# EAGLE design PCB-SSB-2x2 (EAGLE 6.4)
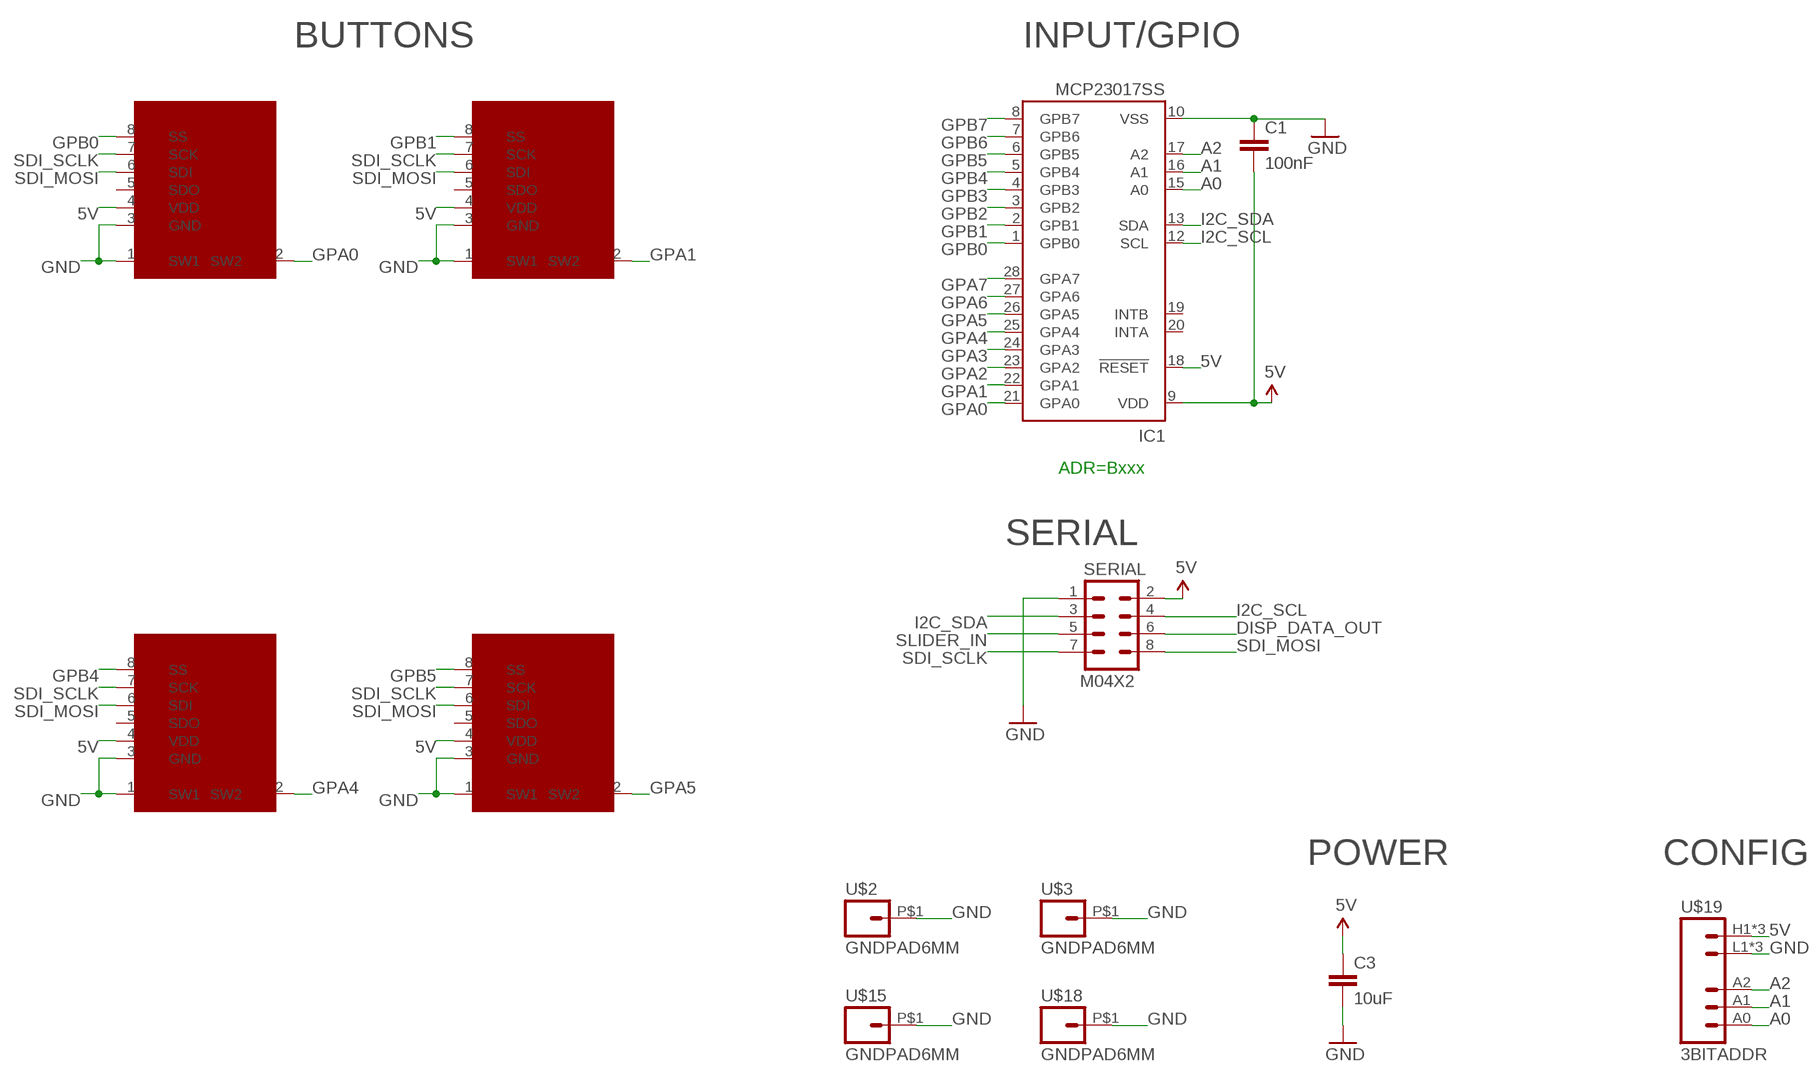
[diagram p0: schematic, sheet 1]

## Parts
C1  100nF  CAP0603-CAP  [0603-CAP]
C3  10uF  CAP0805  [0805]
IC1  MCP23017SS  [SSOP28]
SERIAL  M04X2  [2X4]
SSW1  SMART_SWITCHSMART_SWITCH_8PIN  [SMART_SWITCH]
SSW2  SMART_SWITCHSMART_SWITCH_8PIN  [SMART_SWITCH]
SSW5  SMART_SWITCHSMART_SWITCH_8PIN  [SMART_SWITCH]
SSW6  SMART_SWITCHSMART_SWITCH_8PIN  [SMART_SWITCH]
U$2  GNDPAD6MM  [3.2MMPAD6MM]
U$3  GNDPAD6MM  [3.2MMPAD6MM]
U$15  GNDPAD6MM  [3.2MMPAD6MM]
U$18  GNDPAD6MM  [3.2MMPAD6MM]
U$19  3BITADDR  [3BITADDR]

## Nets
5V [Power]: C1.2 C3.1 IC1.9(VDD) IC1.18(!RESET) SERIAL.2 SSW1.4(VDD) SSW2.4(VDD) SSW5.4(VDD) SSW6.4(VDD) U$19.H1(VCC) U$19.H2(VCC) U$19.H3(VCC)
A0: IC1.15(A0) U$19.A0
A1: IC1.16(A1) U$19.A1
A2: IC1.17(A2) U$19.A2
DISP_DATA_OUT: SERIAL.6
GND [Power]: C1.1 C3.2 IC1.10(VSS) SERIAL.1 SSW1.1(SW1) SSW1.3(GND) SSW2.1(SW1) SSW2.3(GND) SSW5.1(SW1) SSW5.3(GND) SSW6.1(SW1) SSW6.3(GND) U$2.P$1 U$3.P$1 U$15.P$1 U$18.P$1 U$19.L1(GND) U$19.L2(GND) U$19.L3(GND)
GPA0: IC1.21(GPA0) SSW1.2(SW2)
GPA1: IC1.22(GPA1) SSW2.2(SW2)
GPA2: IC1.23(GPA2)
GPA3: IC1.24(GPA3)
GPA4: IC1.25(GPA4) SSW5.2(SW2)
GPA5: IC1.26(GPA5) SSW6.2(SW2)
GPA6: IC1.27(GPA6)
GPA7: IC1.28(GPA7)
GPB0: IC1.1(GPB0) SSW1.8(SS)
GPB1: IC1.2(GPB1) SSW2.8(SS)
GPB2: IC1.3(GPB2)
GPB3: IC1.4(GPB3)
GPB4: IC1.5(GPB4) SSW5.8(SS)
GPB5: IC1.6(GPB5) SSW6.8(SS)
GPB6: IC1.7(GPB6)
GPB7: IC1.8(GPB7)
I2C_SCL: IC1.12(SCL) SERIAL.4
I2C_SDA: IC1.13(SDA) SERIAL.3
SDI_MOSI: SERIAL.8 SSW1.6(SDI) SSW2.6(SDI) SSW5.6(SDI) SSW6.6(SDI)
SDI_SCLK: SERIAL.7 SSW1.7(SCK) SSW2.7(SCK) SSW5.7(SCK) SSW6.7(SCK)
SLIDER_IN: SERIAL.5
Unconnected: IC1.19(INTB) IC1.20(INTA) SSW1.5(SDO) SSW2.5(SDO) SSW5.5(SDO) SSW6.5(SDO)

## Notes on the sheet
- BUTTONS | INPUT/GPIO
- ADR=Bxxx
- SERIAL
- POWER | CONFIG

## Library data of the parts
C1 C3 = SparkFun:CAP: Capacitor Standard 0603 ceramic capacitor, and 0.1" leaded capacitor.
IC1 = microchip:MCP23017: http://ww1.microchip.com/downloads/en/DeviceDoc/21952a.pdf Source: http://ww1.microchip.com/downloads/en/DeviceDoc/21952a.pdf; MF: MICROCHIP; MPN: MCP23017-E/SS; OC_FARNELL: 1467674; OC_NEWARK: 31K2960
SERIAL = SparkFun:M04X2
SSW1 SSW2 SSW5 SSW6 = SKAARHOJ:SMART_SWITCH: SMARTSWITCH IS15DSBFP4RGB www.nkksmartswitch.com
U$2 U$3 U$15 U$18 = SKAARHOJ:GNDPAD
U$19 = SKAARHOJ:3BITADDR

## Net classes
0 default: width 0.203 mm, drill 0.406 mm, clearance 0.203 mm
1 Power: width 0.406 mm, drill 0.61 mm, clearance 0.203 mm

## Board
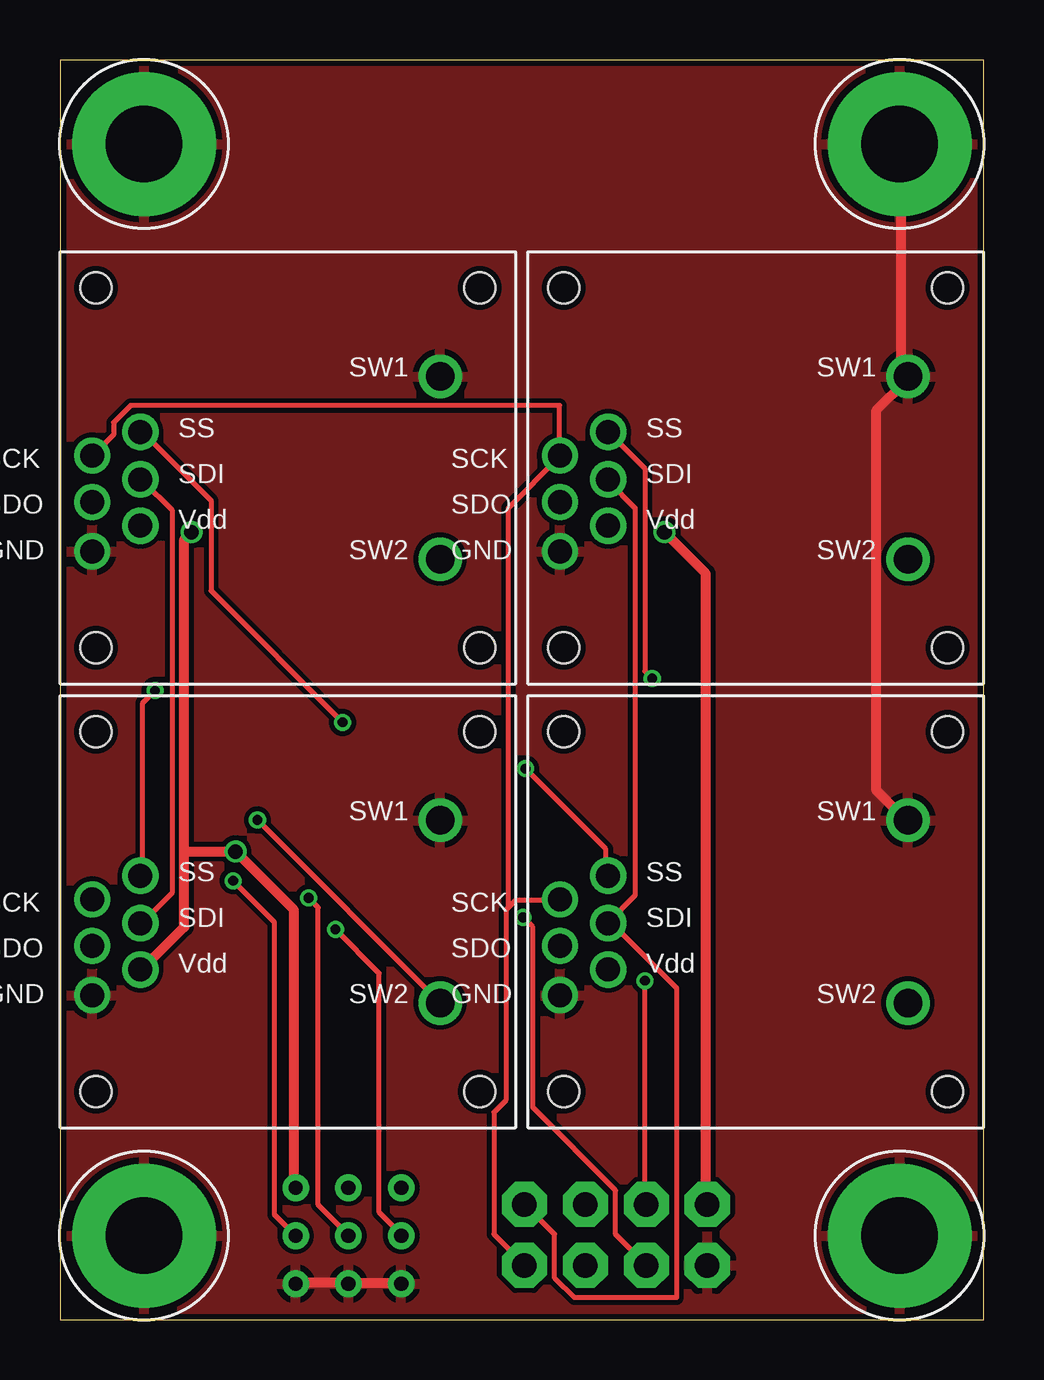
[diagram p1: board, top side]
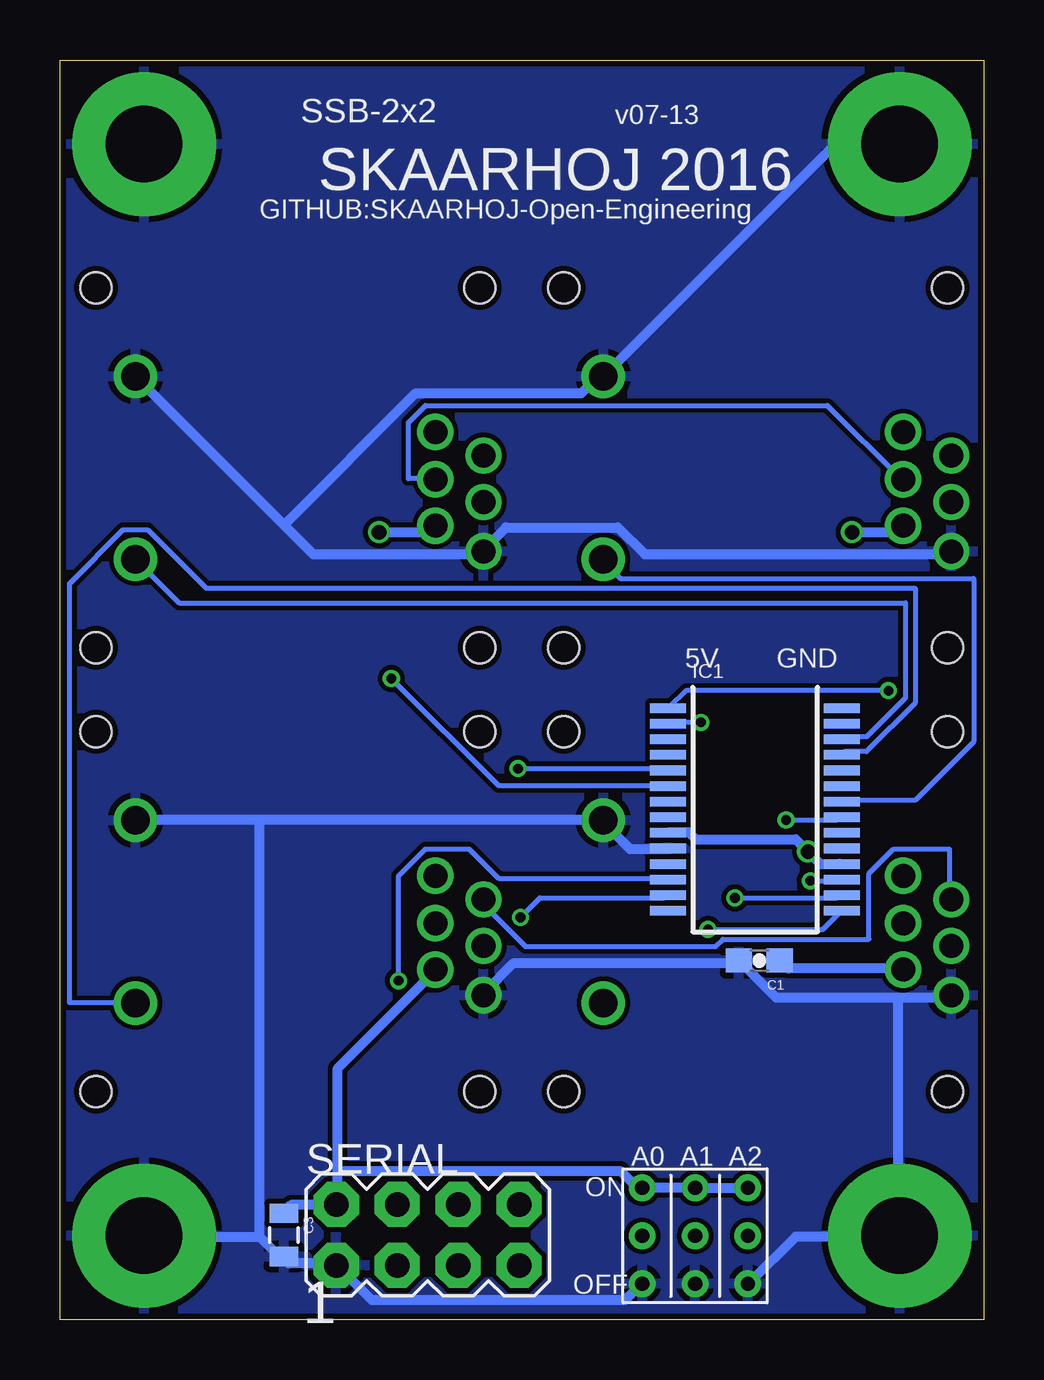
[diagram p2: board, bottom side, seen from below]

Size 38.5 x 52.5 mm. Coordinates in mm from the lower left corner, seen from the top.
Outline: 0,0 38.5,0 38.5,52.5 0,52.5 0,0
Copper layers (1*16): Top 0.035mm / dielectric 1.5mm / Bottom 0.035mm
Design rules "default": minimum track width 6mil, minimum drill 12mil, track to track 6mil, track to pad 6mil, pad to pad 6mil, via to via 6mil, smd to smd 0mil, copper to edge 10mil, drill to drill 10mil, minimum pad ring 10mil, minimum via ring 6mil, stop-mask expansion 2mil, vias tented up to drill 100mil, thermal gap 10mil

### Footprints (pad centres in the part's own frame; a part is rotated, then mirrored left to right if it is on the bottom)
0603-CAP = smd 1.1 x 1: 1 -0.85,0; 2 0.85,0
0805 = smd 0.8 x 1.2: 1 -0.9,0; 2 0.9,0
SSOP28 = smd 0.4 x 1.5: 1 -4.225,-3.625; 2 -3.575,-3.625; 3 -2.925,-3.625; 4 -2.275,-3.625; 5 -1.625,-3.625; 6 -0.975,-3.625; 7 -0.325,-3.625; 8 0.325,-3.625; 9 0.975,-3.625; 10 1.625,-3.625; 11 2.275,-3.625; 12 2.925,-3.625; 13 3.575,-3.625; 14 4.225,-3.625; 15 4.225,3.625; 16 3.575,3.625; 17 2.925,3.625; 18 2.275,3.625; 19 1.625,3.625; 20 0.975,3.625; 21 0.325,3.625; 22 -0.325,3.625; 23 -0.975,3.625; 24 -1.625,3.625; 25 -2.275,3.625; 26 -2.925,3.625; 27 -3.575,3.625; 28 -4.225,3.625
2X4 = drill 1.016 pad 1.88 octagon: 1 -3.81,-1.27; 2 -3.81,1.27; 3 -1.27,-1.27; 4 -1.27,1.27; 5 1.27,-1.27; 6 1.27,1.27; 7 3.81,-1.27; 8 3.81,1.27
SMART_SWITCH = drill 1.2: 1 6.35,3.81; 2 6.35,-3.81 | drill 1: 3 -8.153,-3.48; 4 -6.147,-2.413; 5 -8.153,-1.422; 6 -6.147,-0.483; 7 -8.153,0.508; 8 -6.147,1.499 | hole 1.3: -8.001,7.506; 8.001,7.506; 8.001,-7.506; -8.001,-7.506
3.2MMPAD6MM = drill 3.2 pad 6: P$1 0,0
3BITADDR = drill 0.6: A0 -2.2,0; A1 0,0; A2 2.2,0; H1 -2.2,2; H2 0,2; H3 2.2,2; L1 -2.2,-2; L2 0,-2; L3 2.2,-2

### Placement (x,y rotation side)
C1  9.35,14.96 0 bottom
C3  29.16,3.52 270 bottom
IC1  9.53,21.26 270 bottom
SERIAL  23.17,3.52 0 bottom
SSW1  9.5,17 0 top
SSW2  9.5,35.5 0 top
SSW5  29,17 0 top
SSW6  29,35.5 0 top
U$2  3.5,3.5 0 top
U$3  3.5,49 0 top
U$15  35,3.5 0 top
U$18  35,49 0 top
U$19  12.03,3.49 0 bottom

### Tracks (layer width: path | path; a pad name or v marks a point on that pad's centre or on a via)
5V  (via drill 0.61)
  Top 0.406: v5.49,32.82 5.18,32.51 5.18,19.51 | 5.18,19.51 5.18,16.36 3.45,14.63 SSW1.4 | 5.18,19.51 v7.32,19.51 9.75,17.07 9.75,5.59 U$19.H3 | v25.2,32.82 26.92,31.09 26.92,4.88 SERIAL.2
  Bottom 0.406: IC1.18 5.99,19 6.81,19 v7.32,19.51 7.82,20.02 11.99,20.02 12.29,20.32 13.11,20.32 IC1.9 | C1.2 8.43,14.94 8.13,14.63 3.45,14.63 SSW1.4 | v5.49,32.82 3.66,32.82 3.45,33.02 SSW2.4 | U$19.H3 9.86,5.49 11.99,5.49 U$19.H2 12.19,5.49 U$19.H1 14.43,5.49 15.14,6.2 26.92,6.2 | C3.1 29.16,4.47 28.85,4.78 27.03,4.78 SERIAL.2 26.92,4.98 26.92,6.2 | 26.92,6.2 26.92,10.46 22.86,14.53 SSW5.4 | v25.2,32.82 23.06,32.82 22.86,33.02 SSW6.4
A0  (via drill 0.41)
  Top 0.203: v11.48,16.26 13.31,14.43 13.31,4.47 14.22,3.56 U$19.A0
  Bottom 0.203: v11.48,16.26 6.71,16.26 5.99,16.97 IC1.15
A1  (via drill 0.41)
  Top 0.203: v10.36,17.58 10.77,17.17 10.77,4.78 11.99,3.56 U$19.A1
  Bottom 0.203: v10.36,17.58 6.1,17.58 5.99,17.68 IC1.16
A2  (via drill 0.41)
  Top 0.203: v7.21,18.29 8.94,16.56 8.94,4.37 9.75,3.56 U$19.A2
  Bottom 0.203: v7.21,18.29 5.99,18.29 IC1.17
GND
  Top 0.406: U$18.P$1 35.05,48.97 35.05,39.52 35.26,39.32 SSW6.1 35.26,39.12 34.04,37.9 34.04,22.05 35.26,20.83 SSW5.1 | U$19.L3 9.86,1.52 11.99,1.52 U$19.L2 12.19,1.52 14.22,1.52 U$19.L1
  Bottom 0.406: U$3.P$1 3.56,48.97 6.2,48.97 SSW2.1 16.05,39.32 16.76,38.61 23.67,38.61 29.16,33.12 | SSW2.3 1.42,32 1.52,31.9 14.12,31.9 15.24,33.02 19.91,33.02 20.83,32.11 SSW6.3 21.03,32 21.13,31.9 27.94,31.9 29.16,33.12 | 29.16,33.12 35.26,39.22 SSW6.1 | 3.56,13.41 1.52,13.41 1.42,13.51 SSW1.3 | 3.56,13.41 8.64,13.41 10.16,14.94 C1.1 10.36,14.83 19.61,14.83 20.83,13.61 SSW5.3 | U$19.L3 9.75,1.52 7.82,3.45 3.56,3.45 U$2.P$1 3.56,3.66 3.56,13.41 | IC1.10 13.21,19.61 14.73,19.61 15.85,20.73 SSW1.1 16.05,20.83 30.18,20.83 | 30.18,20.83 35.26,20.83 SSW5.1 | 30.18,3.45 29.36,2.64 C3.2 29.16,2.54 28.96,2.34 27.03,2.34 SERIAL.1 26.82,2.13 25.5,0.81 14.94,0.81 14.33,1.42 U$19.L1 | 30.18,3.45 34.95,3.45 U$15.P$1 | 30.18,3.45 30.18,20.83
  pour Top: 0,0 38.5,0 38.5,52.5 0,52.5
  pour Bottom: 0,0 38.5,0 38.5,52.5 0,52.5 0,0.5
GPA0  (via drill 0.41)
  Top 0.203: v8.23,20.83 15.85,13.21 SSW1.2
  Bottom 0.203: v8.23,20.83 6.1,20.83 5.99,20.93 IC1.21
GPA1
  Bottom 0.203: IC1.22 5.89,21.64 2.85,21.64 0.41,24.08 0.41,30.89 15.14,30.89 15.85,31.6 SSW2.2
GPA4
  Bottom 0.203: IC1.25 5.89,23.57 5.79,23.67 4.88,23.67 2.85,25.7 2.85,30.48 32.41,30.48 34.85,32.92 35.87,32.92 38.1,30.68 38.1,13.21 35.36,13.21 SSW5.2
GPA5
  Bottom 0.203: IC1.26 5.89,24.28 4.88,24.28 3.25,25.91 3.25,29.87 33.53,29.87 35.26,31.6 SSW6.2
GPB0  (via drill 0.41)
  Top 0.203: v3.96,26.21 3.45,25.7 3.45,18.59 SSW1.8
  Bottom 0.203: v3.96,26.21 12.39,26.21 13.11,25.5 IC1.1
GPB1  (via drill 0.41)
  Top 0.203: v11.79,24.89 6.3,30.38 6.3,34.14 3.45,36.98 SSW2.8
  Bottom 0.203: v11.79,24.89 13.11,24.89 IC1.2
GPB4  (via drill 0.41)
  Top 0.203: v19.41,22.96 22.76,19.61 22.76,18.59 SSW5.8
  Bottom 0.203: v19.41,22.96 13.21,22.96 IC1.5
GPB5  (via drill 0.41)
  Top 0.203: v24.69,26.72 24.38,27.03 24.38,35.46 22.86,36.98 SSW6.8
  Bottom 0.203: v24.69,26.72 20.22,22.25 13.21,22.25 IC1.6
I2C_SCL  (via drill 0.41)
  Top 0.203: v24.38,14.12 24.38,4.88 SERIAL.4
  Bottom 0.203: v24.38,14.12 24.38,18.49 23.27,19.61 21.44,19.61 20.22,18.39 13.21,18.39 IC1.12
I2C_SDA  (via drill 0.41)
  Top 0.203: v19.3,16.76 19.71,16.36 19.71,8.84 23.16,5.38 23.16,3.56 24.38,2.34 SERIAL.3
  Bottom 0.203: v19.3,16.76 18.49,17.58 13.31,17.58 13.21,17.68 IC1.13
SDI_MOSI
  Top 0.203: SSW1.6 3.45,16.56 4.67,17.78 4.67,33.73 3.45,34.95 SSW2.6 | SSW6.6 22.86,34.95 23.98,33.83 23.98,17.68 22.86,16.56 SSW5.6 22.96,16.56 25.7,13.82 25.7,0.91 21.44,0.91 20.62,1.73 20.62,3.56 19.41,4.78 SERIAL.8
  Bottom 0.203: SSW2.6 3.45,35.05 6.5,38.1 23.27,38.1 23.98,37.39 23.98,35.05 22.86,35.05 SSW6.6
SDI_SCLK
  Top 0.203: SSW2.7 1.42,36.07 2.23,36.88 2.23,37.39 2.95,38.1 20.83,38.1 20.83,36.07 SSW6.7 20.83,35.97 18.69,33.83 18.69,17.27 18.75,17.22 | 18.75,17.22 19,17.48 20.83,17.48 SSW5.7 | 18.75,17.22 18.59,17.07 18.59,9.14 18.09,8.64 18.09,3.56 19.3,2.34 SERIAL.7
  Bottom 0.203: SSW1.7 1.42,17.58 1.42,19.61 3.76,19.61 4.78,18.59 4.78,15.85 10.87,15.85 11.18,15.54 19.1,15.54 20.83,17.27 20.83,17.48 SSW5.7

### Text on the board
_bsilk: v07-13 | SSB-2x2 | SKAARHOJ 2016 | GITHUB:SKAARHOJ-Open-Engineering | GND | 5V | 1